# Altium project WheelLED_LiLED.PrjPCB
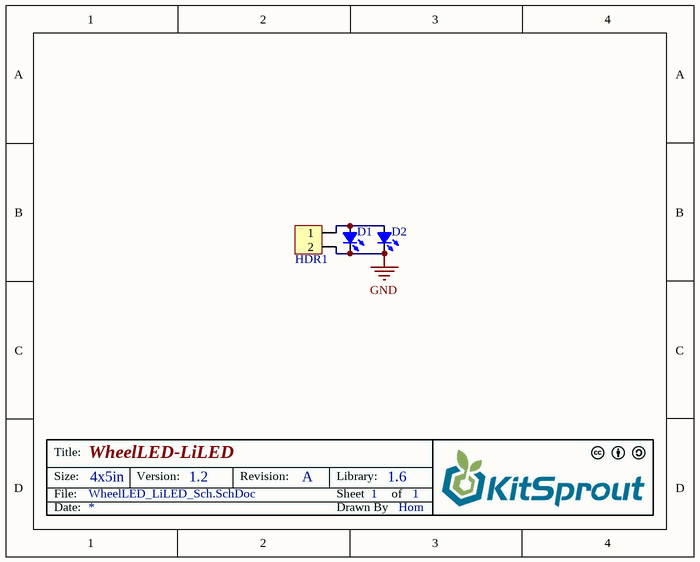
[diagram p0: WheelLED_LiLED_Sch.SchDoc]
1 sheet, 3 parts. Net scope: global (net labels, ports and power ports of the same name join across sheets).
Board file: WheelLED_LiLED_Pcb.PcbDoc

## Sheet WheelLED_LiLED_Sch.SchDoc: WheelLED-LiLED
size 127 x 101 mm; Author: Hom; CompanyName: KitSprout; DrawnBy: Hom; Engineer: Hom; Organization: KitSprout; Revision: A; SheetNumber: 1; SheetTotal: 1; License: CC BY-SA 4.0; Version: 1.2; LibVersion: 1.6; PageSetup: Record=PageOptions|CenterHorizontal=True|CenterVertical=True|PrintScale=1.00|XCorrection=1.00|YCorrection=1.00|PrintKind=0|BorderSize=5000000|LeftOffset=0|BottomOffset=0|Orientation=2|PaperLength=1000|PaperWidth=1000|Scale=100|PaperSource=7|PrintQuality=-3|MediaType=1|DitherType=10|PrintScaleMode=0|PaperKind=A4|PaperIndex=9

### Parts
D1  LED_5730  [LED_5730_WHITE]  (value not drawn)
D2  LED_5730  [LED_5730_WHITE]  (value not drawn)
HDR1  HDR1x2_2.54  [HDR1X2_2.54_180F]  (value not drawn)

### Nets
GND: D1.2(K) D2.2(K) HDR1.2
NetD1_1: D1.1(A) D2.1(A) HDR1.1

### Notes on the sheet
- Title:
- Size:
- Date:
- File:
- 4x5in
- Version:
- Revision:
- Sheet
- Drawn By
- Library:
- of

### Library data of the parts
D1 D2 = LED_5730: LED
HDR1 = HDR1x2_2.54T: Header